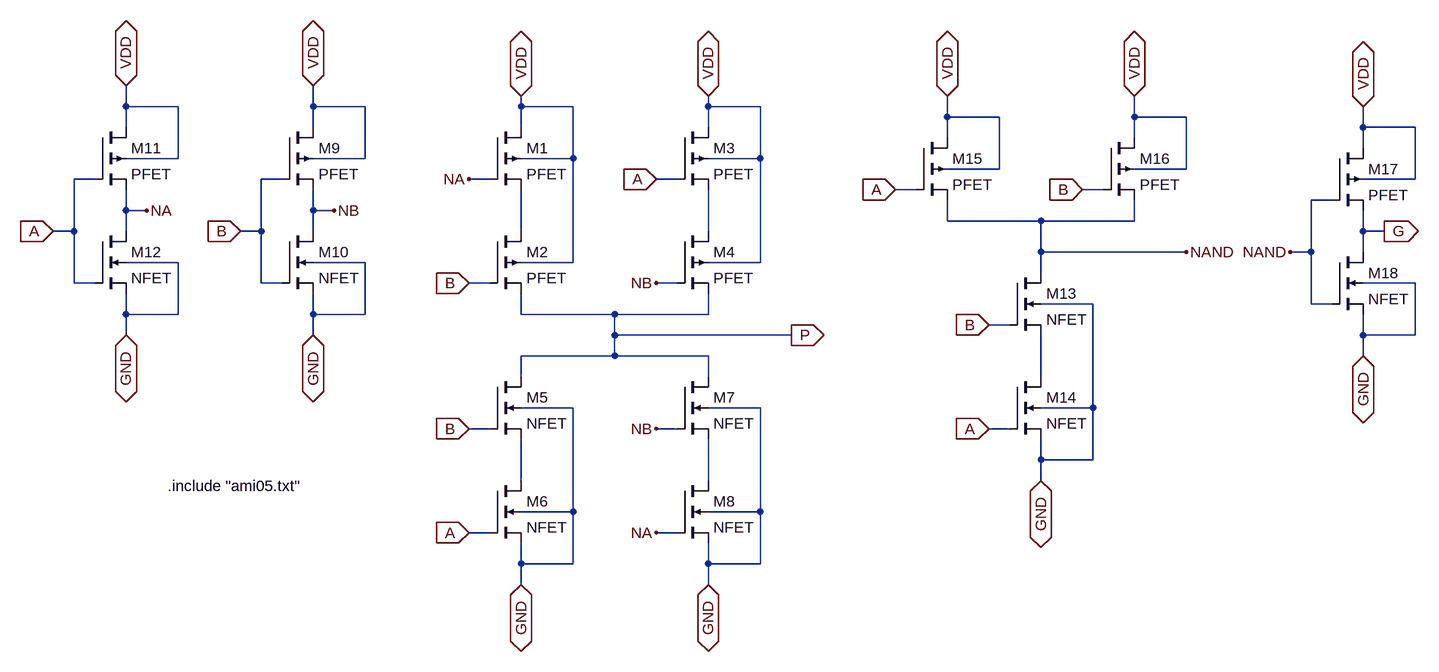
[diagram p0: schematic bitwise.asc]
bitwise.asc, the LTspice schematic file:
Version 4
SHEET 1 1584 680
WIRE -464 -240 -464 -272
WIRE -384 -240 -464 -240
WIRE -176 -240 -176 -272
WIRE -96 -240 -176 -240
WIRE 144 -240 144 -256
WIRE 224 -240 144 -240
WIRE 432 -240 432 -256
WIRE 512 -240 432 -240
WIRE 800 -224 800 -256
WIRE 880 -224 800 -224
WIRE 1088 -224 1088 -256
WIRE 1168 -224 1088 -224
WIRE -464 -208 -464 -240
WIRE -176 -208 -176 -240
WIRE 144 -208 144 -240
WIRE 432 -208 432 -240
WIRE 1440 -208 1440 -240
WIRE 1520 -208 1440 -208
WIRE 800 -192 800 -224
WIRE 1088 -192 1088 -224
WIRE 1440 -176 1440 -208
WIRE -384 -160 -384 -240
WIRE -384 -160 -464 -160
WIRE -96 -160 -96 -240
WIRE -96 -160 -176 -160
WIRE 224 -160 224 -240
WIRE 224 -160 144 -160
WIRE 512 -160 512 -240
WIRE 512 -160 432 -160
WIRE 880 -144 880 -224
WIRE 880 -144 800 -144
WIRE 1168 -144 1168 -224
WIRE 1168 -144 1088 -144
WIRE -512 -128 -544 -128
WIRE -224 -128 -256 -128
WIRE 96 -128 64 -128
WIRE 384 -128 352 -128
WIRE 1520 -128 1520 -208
WIRE 1520 -128 1440 -128
WIRE 752 -112 720 -112
WIRE 1040 -112 1008 -112
WIRE 1392 -96 1360 -96
WIRE -464 -80 -464 -112
WIRE -432 -80 -464 -80
WIRE -176 -80 -176 -112
WIRE -144 -80 -176 -80
WIRE 800 -64 800 -96
WIRE 944 -64 800 -64
WIRE 1088 -64 1088 -96
WIRE 1088 -64 944 -64
WIRE -544 -48 -544 -128
WIRE -544 -48 -576 -48
WIRE -464 -48 -464 -80
WIRE -256 -48 -256 -128
WIRE -256 -48 -288 -48
WIRE -176 -48 -176 -80
WIRE 144 -48 144 -112
WIRE 432 -48 432 -112
WIRE 1440 -48 1440 -80
WIRE 1472 -48 1440 -48
WIRE 944 -16 944 -64
WIRE 1168 -16 944 -16
WIRE 1360 -16 1360 -96
WIRE 1360 -16 1328 -16
WIRE 1440 -16 1440 -48
WIRE -384 0 -464 0
WIRE -96 0 -176 0
WIRE 224 0 224 -160
WIRE 224 0 144 0
WIRE 512 0 512 -160
WIRE 512 0 432 0
WIRE 944 16 944 -16
WIRE -544 32 -544 -48
WIRE -512 32 -544 32
WIRE -256 32 -256 -48
WIRE -224 32 -256 32
WIRE 96 32 64 32
WIRE 384 32 352 32
WIRE 1520 32 1440 32
WIRE 1024 64 944 64
WIRE 1360 64 1360 -16
WIRE 1392 64 1360 64
WIRE -464 80 -464 48
WIRE -384 80 -384 0
WIRE -384 80 -464 80
WIRE -176 80 -176 48
WIRE -96 80 -96 0
WIRE -96 80 -176 80
WIRE 144 80 144 48
WIRE 288 80 144 80
WIRE 432 80 432 48
WIRE 432 80 288 80
WIRE 896 96 864 96
WIRE -464 112 -464 80
WIRE -176 112 -176 80
WIRE 288 112 288 80
WIRE 560 112 288 112
WIRE 1440 112 1440 80
WIRE 1520 112 1520 32
WIRE 1520 112 1440 112
WIRE 288 144 288 112
WIRE 288 144 144 144
WIRE 432 144 288 144
WIRE 1440 144 1440 112
WIRE 144 176 144 144
WIRE 432 176 432 144
WIRE 944 176 944 112
WIRE 224 224 144 224
WIRE 512 224 432 224
WIRE 1024 224 1024 64
WIRE 1024 224 944 224
WIRE 96 256 64 256
WIRE 384 256 352 256
WIRE 896 256 864 256
WIRE 944 304 944 272
WIRE 1024 304 1024 224
WIRE 1024 304 944 304
WIRE 144 336 144 272
WIRE 432 336 432 272
WIRE 944 336 944 304
WIRE 224 384 224 224
WIRE 224 384 144 384
WIRE 512 384 512 224
WIRE 512 384 432 384
WIRE 96 416 64 416
WIRE 384 416 352 416
WIRE 144 464 144 432
WIRE 224 464 224 384
WIRE 224 464 144 464
WIRE 432 464 432 432
WIRE 512 464 512 384
WIRE 512 464 432 464
WIRE 144 496 144 464
WIRE 432 496 432 464
FLAG 144 -256 VDD
IOPIN 144 -256 BiDir
FLAG 432 -256 VDD
IOPIN 432 -256 BiDir
FLAG 64 -128 NA
FLAG 352 416 NA
FLAG 64 32 B
IOPIN 64 32 In
FLAG 64 256 B
IOPIN 64 256 In
FLAG 352 -128 A
IOPIN 352 -128 In
FLAG 352 32 NB
FLAG 352 256 NB
FLAG 64 416 A
IOPIN 64 416 In
FLAG 144 496 GND
IOPIN 144 496 BiDir
FLAG 432 496 GND
IOPIN 432 496 BiDir
FLAG 560 112 P
IOPIN 560 112 Out
FLAG -176 -272 VDD
IOPIN -176 -272 BiDir
FLAG -176 112 GND
IOPIN -176 112 BiDir
FLAG -144 -80 NB
FLAG -288 -48 B
IOPIN -288 -48 In
FLAG -464 -272 VDD
IOPIN -464 -272 BiDir
FLAG -464 112 GND
IOPIN -464 112 BiDir
FLAG -432 -80 NA
FLAG -576 -48 A
IOPIN -576 -48 In
FLAG 864 96 B
IOPIN 864 96 In
FLAG 864 256 A
IOPIN 864 256 In
FLAG 944 336 GND
IOPIN 944 336 BiDir
FLAG 720 -112 A
IOPIN 720 -112 In
FLAG 1008 -112 B
IOPIN 1008 -112 In
FLAG 800 -256 VDD
IOPIN 800 -256 BiDir
FLAG 1088 -256 VDD
IOPIN 1088 -256 BiDir
FLAG 1168 -16 NAND
FLAG 1440 -240 VDD
IOPIN 1440 -240 BiDir
FLAG 1440 144 GND
IOPIN 1440 144 BiDir
FLAG 1472 -48 G
IOPIN 1472 -48 Out
FLAG 1328 -16 NAND
SYMBOL pmos4 96 -208 R0
SYMATTR InstName M1
SYMATTR Value PFET
SYMATTR Value2 l=0.6u w=6u
SYMBOL pmos4 96 -48 R0
SYMATTR InstName M2
SYMATTR Value PFET
SYMATTR Value2 l=0.6u w=6u
SYMBOL pmos4 384 -208 R0
SYMATTR InstName M3
SYMATTR Value PFET
SYMATTR Value2 l=0.6u w=6u
SYMBOL pmos4 384 -48 R0
SYMATTR InstName M4
SYMATTR Value PFET
SYMATTR Value2 l=0.6u w=6u
SYMBOL nmos4 96 176 R0
SYMATTR InstName M5
SYMATTR Value NFET
SYMATTR Value2 l=0.6u w=3u
SYMBOL nmos4 96 336 R0
SYMATTR InstName M6
SYMATTR Value NFET
SYMATTR Value2 l=0.6u w=3u
SYMBOL nmos4 384 176 R0
SYMATTR InstName M7
SYMATTR Value NFET
SYMATTR Value2 l=0.6u w=3u
SYMBOL nmos4 384 336 R0
SYMATTR InstName M8
SYMATTR Value NFET
SYMATTR Value2 l=0.6u w=3u
SYMBOL pmos4 -224 -208 R0
SYMATTR InstName M9
SYMATTR Value PFET
SYMATTR Value2 l=0.6u w=3u
SYMBOL nmos4 -224 -48 R0
SYMATTR InstName M10
SYMATTR Value NFET
SYMATTR Value2 l=0.6u w=1.5u
SYMBOL pmos4 -512 -208 R0
SYMATTR InstName M11
SYMATTR Value PFET
SYMATTR Value2 l=0.6u w=3u
SYMBOL nmos4 -512 -48 R0
SYMATTR InstName M12
SYMATTR Value NFET
SYMATTR Value2 l=0.6u w=1.5u
SYMBOL nmos4 896 16 R0
SYMATTR InstName M13
SYMATTR Value NFET
SYMATTR Value2 l=0.6u w=3u
SYMBOL nmos4 896 176 R0
SYMATTR InstName M14
SYMATTR Value NFET
SYMATTR Value2 l=0.6u w=3u
SYMBOL pmos4 752 -192 R0
SYMATTR InstName M15
SYMATTR Value PFET
SYMATTR Value2 l=0.6u w=3u
SYMBOL pmos4 1040 -192 R0
SYMATTR InstName M16
SYMATTR Value PFET
SYMATTR Value2 l=0.6u w=3u
SYMBOL pmos4 1392 -176 R0
SYMATTR InstName M17
SYMATTR Value PFET
SYMATTR Value2 l=0.6u w=3u
SYMBOL nmos4 1392 -16 R0
SYMATTR InstName M18
SYMATTR Value NFET
SYMATTR Value2 l=0.6u w=1.5u
TEXT -400 344 Left 2 !.include "ami05.txt"

The netlist it stands for:
* bitwise.asc
M1 VDD NA N001 VDD PFET l=0.6u w=6u
M2 N001 B P VDD PFET l=0.6u w=6u
M3 VDD A N002 VDD PFET l=0.6u w=6u
M4 N002 NB P VDD PFET l=0.6u w=6u
M5 P B N004 GND NFET l=0.6u w=3u
M6 N004 A GND GND NFET l=0.6u w=3u
M7 P NB N005 GND NFET l=0.6u w=3u
M8 N005 NA GND GND NFET l=0.6u w=3u
M9 VDD B NB VDD PFET l=0.6u w=3u
M10 NB B GND GND NFET l=0.6u w=1.5u
M11 VDD A NA VDD PFET l=0.6u w=3u
M12 NA A GND GND NFET l=0.6u w=1.5u
M13 NAND B N003 GND NFET l=0.6u w=3u
M14 N003 A GND GND NFET l=0.6u w=3u
M15 VDD A NAND VDD PFET l=0.6u w=3u
M16 VDD B NAND VDD PFET l=0.6u w=3u
M17 VDD NAND G VDD PFET l=0.6u w=3u
M18 G NAND GND GND NFET l=0.6u w=1.5u
.model NMOS NMOS
.model PMOS PMOS
.lib standard.mos
.include "ami05.txt"
.backanno
.end